# Altium schematic sheet Cells.SchDoc
size 190 x 114 mm
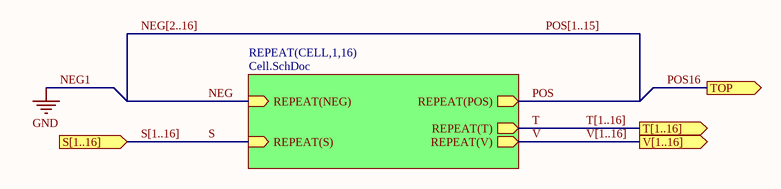
[diagram p0: Cells.SchDoc]

## Sub-sheets
REPEAT(CELL,1,16) = Cell.SchDoc: REPEAT(NEG) (in), REPEAT(POS) (out), REPEAT(T) (out), REPEAT(V) (out), REPEAT(S) (in)

## Ports
S[1..16] (in), T[1..16] (out), TOP (out), V[1..16] (out)

## Nets
NEG: sheet REPEAT(CELL,1,16)/REPEAT(NEG)
POS: sheet REPEAT(CELL,1,16)/REPEAT(POS)
POS16: port TOP
S: sheet REPEAT(CELL,1,16)/REPEAT(S)
T: sheet REPEAT(CELL,1,16)/REPEAT(T)
V: sheet REPEAT(CELL,1,16)/REPEAT(V)

## Buses and harness runs
bus NEG[2..16] = POS[1..15]
bus S[1..16] = port S[1..16]
bus T[1..16] = port T[1..16]
bus V[1..16] = port V[1..16]